# EAGLE design i2c-relais (EAGLE 6.6.0)
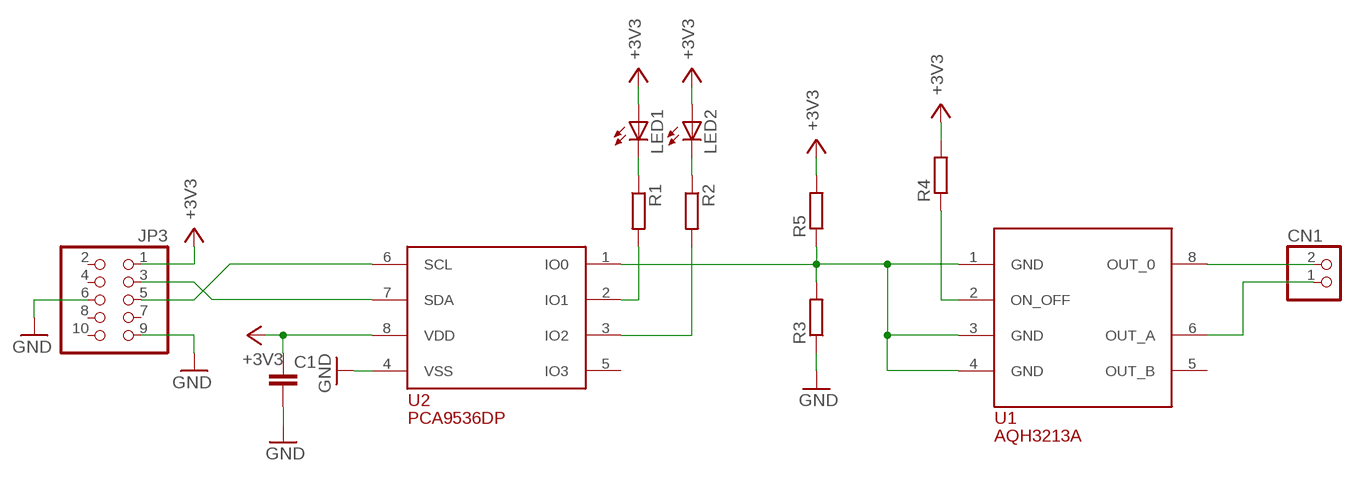
[diagram p0: schematic, sheet 1]

## Parts
C1  C-EUC0805  [C0805]
CN1  JST_2PIN-SMT-RA  [JST-PH-2-SMT-RA]
JP3  PINHD-2X5  [2X05]
LED1  LEDCHIPLED_0805  [CHIPLED_0805]
LED2  LEDCHIPLED_0805  [CHIPLED_0805]
R1  R-EU_M0805  [M0805]
R2  R-EU_M0805  [M0805]
R3  R-EU_M0805  [M0805]
R4  R-EU_M0805  [M0805]
R5  R-EU_M0805  [M0805]
U1  AQH3213A  AQH-SSD  [DIP8]
U2  PCA9536DP  [TSSOP8]

## Nets
GND: C1.2 JP3.6 JP3.9 R3.1 U2.4(VSS)
N$1: R3.2 R5.1 U1.1(GND) U1.3(GND) U1.4(GND) U2.1(IO0)
N$2: CN1.1 U1.6(OUT_A)
N$4: CN1.2 U1.8(OUT_0)
N$5: R4.1 U1.2(ON_OFF)
N$6: R2.2 U2.3(IO2)
N$10: LED1.C R1.1
N$11: LED2.C R2.1
R1: R1.2 U2.2(IO1)
SCL: JP3.5 U2.6(SCL)
SDA: JP3.3 U2.7(SDA)
U2: C1.1 JP3.1 LED1.A LED2.A R4.2 R5.2 U2.8(VDD) ; supply symbol labelled +3V3
Unconnected: JP3.2 JP3.4 JP3.7 JP3.8 JP3.10 U1.5(OUT_B) U2.5(IO3)

## Library data of the parts
C1 = resistor:C-EU: CAPACITOR, European symbol
CN1 = adafruit:JST_2PIN: JST 2-Pin Connectors of various flavors SMT-RA (S2B-PH-SM4) 4UConnector #17311 SMT (B2B-PH-SM4) THM-RA (S2B-PH) THM (B2B-PH)
JP3 = pinhead:PINHD-2X5: PIN HEADER
LED1 LED2 = led:LED: LED OSRAM: - CHIPLED LG R971, LG N971, LY N971, LG Q971, LY Q971, LO R971, LY R971 LH N974, LH R974 LS Q976, LO Q976, LY Q976 LO Q996 - Hyper CHIPLED LW Q18S LB Q993, LB Q99A, LB R99A - SideLED LS A670, LO A670, LY A670, LG A670, LP A670 LB A673, LV A673, LT A673, LW A673 LH A674 LY A675 LS A676, LA A676, LO A676, LY A676, LW A676 LS A679, LY A679, LG A679 - Hyper Micro SIDELED® LS Y876, LA Y876, LO Y876, LY Y876 LT Y87S - SmartLED LW L88C, LW L88S LB L89C, LB L89S, LG L890 LS L89K, LO L89K, LY L89K LS L896, LA L896, LO L896, LY L896 - TOPLED LS T670, LO T670, LY T670, LG T670, LP T670 LSG T670, LSP T670, LSY T670, LOP T670, LYG T670 LG T671, LOG T671, LSG T671 LB T673, LV T673, LT T673, LW T673 LH T674 LS T676, LA T676, LO T676, LY T676, LB T676, LH T676, LSB T676, LW T676 LB T67C, LV T67C, LT T67C, LS T67K, LO T67K, LY T67K, LW E67C LS E67B, LA E67B, LO E67B, LY E67B, LB E67C, LV E67C, LT E67C LW T67C LS T679, LY T679, LG T679 LS T770, LO T770, LY T770, LG T770, LP T770 LB T773, LV T773, LT T773, LW T773 LH T774 LS E675, LA E675, LY E675, LS T675 LS T776, LA T776, LO T776, LY T776, LB T776 LHGB T686 LT T68C, LB T68C - Hyper Mini TOPLED® LB M676 - Mini TOPLED Santana® LG M470 LS M47K, LO M47K, LY M47K Source: http://www.osram.convergy.de LUXEON: - LUMILED® LXK2-PW12-R00, LXK2-PW12-S00, LXK2-PW14-U00, LXK2-PW14-V00 LXK2-PM12-R00, LXK2-PM12-S00, LXK2-PM14-U00 LXK2-PE12-Q00, LXK2-PE12-R00, LXK2-PE12-S00, LXK2-PE14-T00, LXK2-PE14-U00 LXK2-PB12-K00, LXK2-PB12-L00, LXK2-PB12-M00, LXK2-PB14-N00, LXK2-PB14-P00, LXK2-PB14-Q00 LXK2-PR12-L00, LXK2-PR12-M00, LXK2-PR14-Q00, LXK2-PR14-R00 LXK2-PD12-Q00, LXK2-PD12-R00, LXK2-PD12-S00 LXK2-PH12-R00, LXK2-PH12-S00 LXK2-PL12-P00, LXK2-PL12-Q00, LXK2-PL12-R00 Source: www.luxeon.com KINGBRIGHT: KA-3528ASYC Source: www.kingbright.com
R1-R5 = resistor:R-EU_: RESISTOR, European symbol
U1 = fxkr_aqh2223ax:AQH-SSD: e.g.: AQH3213A (Digikey <https://www.digikey.com/product-detail/en/AQH3213A/255-2661-ND/2125783>) AQH2223AX (Digikey <https://www.digikey.com/product-detail/en/AQH2223AX/255-3922-1-ND/3885629>)
U2 = fxkr_pca9653:PCA9536DP: NXP PCA953DP IC I/O EXPANDER I2C 4B 8TSSOP DP = TSSOP8 Version https://www.digikey.de/product-detail/en/PCA9536DP,118/568-1836-1-ND/789968 http://www.nxp.com/documents/data_sheet/PCA9536.pdf

## Board
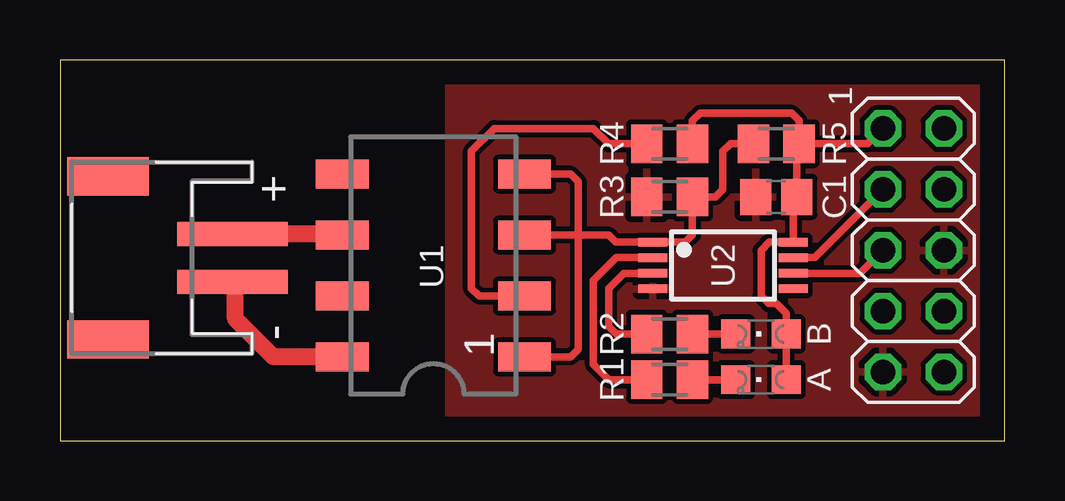
[diagram p1: board, top side]

Size 39.37 x 15.88 mm. Coordinates in mm from the lower left corner, seen from the top.
Outline: 0,0 39.37,0 39.37,15.88 0,15.88 0,0
Copper layers (1*16): Top 0.035mm / dielectric 1.5mm / Bottom 0.035mm
Design rules "default": minimum track width 10mil, minimum drill 24mil, track to track 8mil, track to pad 8mil, pad to pad 8mil, via to via 8mil, smd to smd 8mil, copper to edge 40mil, drill to drill 8mil, minimum pad ring 10mil, minimum via ring 8mil, stop-mask expansion 4mil, vias tented up to drill 0mil, thermal gap 10mil

### Footprints (pad centres in the part's own frame; a part is rotated, then mirrored left to right if it is on the bottom)
C0805 = smd 1.3 x 1.5: 1 -0.85,0; 2 0.85,0
JST-PH-2-SMT-RA = smd 1 x 4.6: 1 1,-3.7; 2 -1,-3.7 | smd 1.6 x 3.4: NC1 -3.4,1.5; NC2 3.4,1.5
2X05 = drill 1.016 octagon: 1 -5.08,-1.27; 2 -5.08,1.27; 3 -2.54,-1.27; 4 -2.54,1.27; 5 0,-1.27; 6 0,1.27; 7 2.54,-1.27; 8 2.54,1.27; 9 5.08,-1.27; 10 5.08,1.27
CHIPLED_0805 = smd 1.2 x 1.2: A 0,-1.05; C 0,1.05
M0805 = smd 1.3 x 1.6: 1 -0.95,0; 2 0.95,0
DIP8 = smd 1.2 x 2.2: 1 -3.81,-3.8; 2 -1.27,-3.8; 3 1.27,-3.8; 4 3.81,-3.8; 5 3.81,3.8; 6 1.27,3.8; 7 -1.27,3.8; 8 -3.81,3.8
TSSOP8 = smd 1.2 x 0.35: 1 -2.925,0.975; 2 -2.925,0.325; 3 -2.925,-0.325; 4 -2.925,-0.975; 5 2.925,-0.975; 6 2.925,-0.325; 7 2.925,0.325; 8 2.925,0.975

### Placement (x,y rotation side)
C1  29.84,10.16 180 top
CN1  3.49,7.62 90 top
JP3  35.56,7.94 270 top
LED1  29.21,2.54 90 top
LED2  29.21,4.45 90 top
R1  25.4,2.54 180 top
R2  25.4,4.45 180 top
R3  25.4,10.16 0 top
R4  25.4,12.38 0 top
R5  29.84,12.38 0 top
U1  15.56,7.3 90 top
U2  27.62,7.3 0 top

### Tracks (layer width: path | path; a pad name or v marks a point on that pad's centre or on a via)
GND
  pour Top: 16.19,15.56 38.42,15.56 38.42,0.32 16.19,0.32
N$1
  Top 0.305: R5.1 27.94,12.38 27.62,12.06 27.62,10.48 27.3,10.16 R3.2 26.35,10.47 26.35,8.57 26.06,8.28 U2.1 23.16,8.28 22.86,8.57 21.59,8.57 | 21.59,8.57 21.59,10.79 21.27,11.11 U1.4 | 21.59,8.57 21.59,3.81 21.27,3.49 U1.1 | 21.59,8.57 U1.3
N$2
  Top 0.305: U1.6 11.71,8.62
  Top 0.711: 11.71,8.62 CN1.1
N$4
  Top 0.305: 7.3,6.51 CN1.2
  Top 0.711: U1.8 8.89,3.49 7.3,5.08 7.3,6.51
N$5
  Top 0.305: U1.2 17.46,6.03 17.14,6.35 17.14,12.06 18.1,13.02 22.23,13.02 22.86,12.38 R4.1
N$6
  Top 0.305: U2.3 23.49,6.98 22.86,6.35 22.86,4.76 23.18,4.45 R2.2
N$10
  Top 0.305: LED1.C R1.1
N$11
  Top 0.305: LED2.C R2.1
R1
  Top 0.305: U2.2 23.18,7.63 22.23,6.67 22.23,3.17 22.86,2.54 R1.2
SCL
  Top 0.305: U2.6 33.33,6.98 JP3.5
SDA
  Top 0.305: U2.7 31.44,7.63 JP3.3
U2
  Top 0.305: R5.2 30.7,13.02 C1.1 30.55,10.48 U2.8 29.55,8.28 29.21,7.94 29.21,6.03 29.53,5.71 29.84,5.71 30.26,5.3 LED2.A LED1.A | R5.2 30.8,13.02 30.8,13.34 30.48,13.65 26.67,13.65 26.35,13.34 26.35,13.02 R4.2 | R5.2 33.66,12.38 JP3.1

### Text on the board
tNames: 1 | B | A